# Altium project power-v3.1.PrjPCB (part 1 of 2)
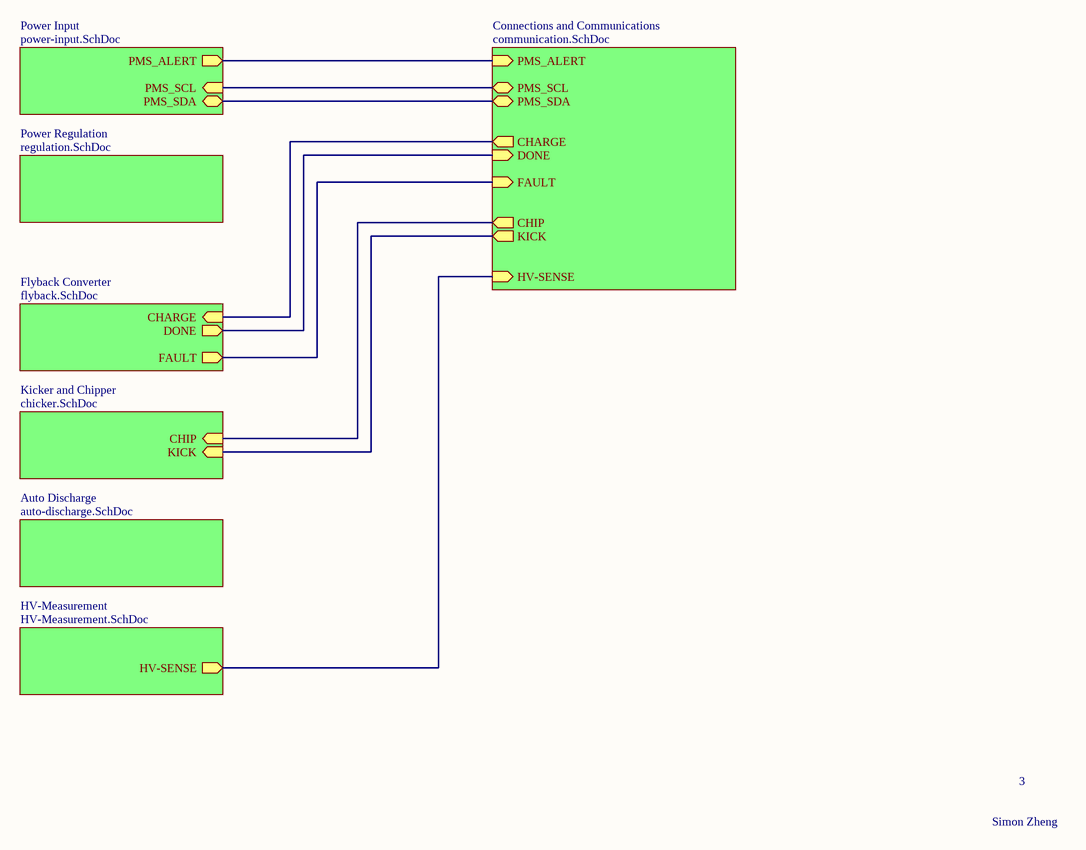
[diagram p0: power-v3.1.SchDoc]
8 sheets, 154 parts. Net scope: hierarchical (ports join the sheet entries above them; power ports are global).
Board file: power-v3.1.PcbDoc
Sheets:
  power-v3.1.SchDoc
    Flyback Converter = flyback.SchDoc
    Power Regulation = regulation.SchDoc
    Kicker and Chipper = chicker.SchDoc
    Power Input = power-input.SchDoc
    Connections and Communications = communication.SchDoc
    Auto Discharge = auto-discharge.SchDoc
    HV-Measurement = HV-Measurement.SchDoc

## Sheet power-v3.1.SchDoc
size A4

### Sub-sheets
Auto Discharge = auto-discharge.SchDoc: no entries
Connections and Communications = communication.SchDoc: PMS_SCL (bidir), PMS_SDA (bidir), DONE (in), CHARGE (out), PMS_ALERT (in), FAULT (in), KICK (out), HV-SENSE (in), CHIP (out)
Flyback Converter = flyback.SchDoc: FAULT (out), DONE (out), CHARGE (in)
HV-Measurement = HV-Measurement.SchDoc: HV-SENSE (out)
Kicker and Chipper = chicker.SchDoc: CHIP (in), KICK (in)
Power Input = power-input.SchDoc: PMS_SDA (bidir), PMS_SCL (in), PMS_ALERT (out)
Power Regulation = regulation.SchDoc: no entries

### Nets
CHARGE: sheet Flyback Converter/CHARGE, sheet Connections and Communications/CHARGE
CHIP: sheet Kicker and Chipper/CHIP, sheet Connections and Communications/CHIP
DONE: sheet Flyback Converter/DONE, sheet Connections and Communications/DONE
FAULT: sheet Flyback Converter/FAULT, sheet Connections and Communications/FAULT
HV-SENSE: sheet Connections and Communications/HV-SENSE, sheet HV-Measurement/HV-SENSE
KICK: sheet Kicker and Chipper/KICK, sheet Connections and Communications/KICK
PMS_ALERT: sheet Power Input/PMS_ALERT, sheet Connections and Communications/PMS_ALERT
PMS_SCL: sheet Power Input/PMS_SCL, sheet Connections and Communications/PMS_SCL
PMS_SDA: sheet Power Input/PMS_SDA, sheet Connections and Communications/PMS_SDA

### Notes on the sheet
- 3
- Simon Zheng

## Sheet flyback.SchDoc
size A4; SheetNumber: 4
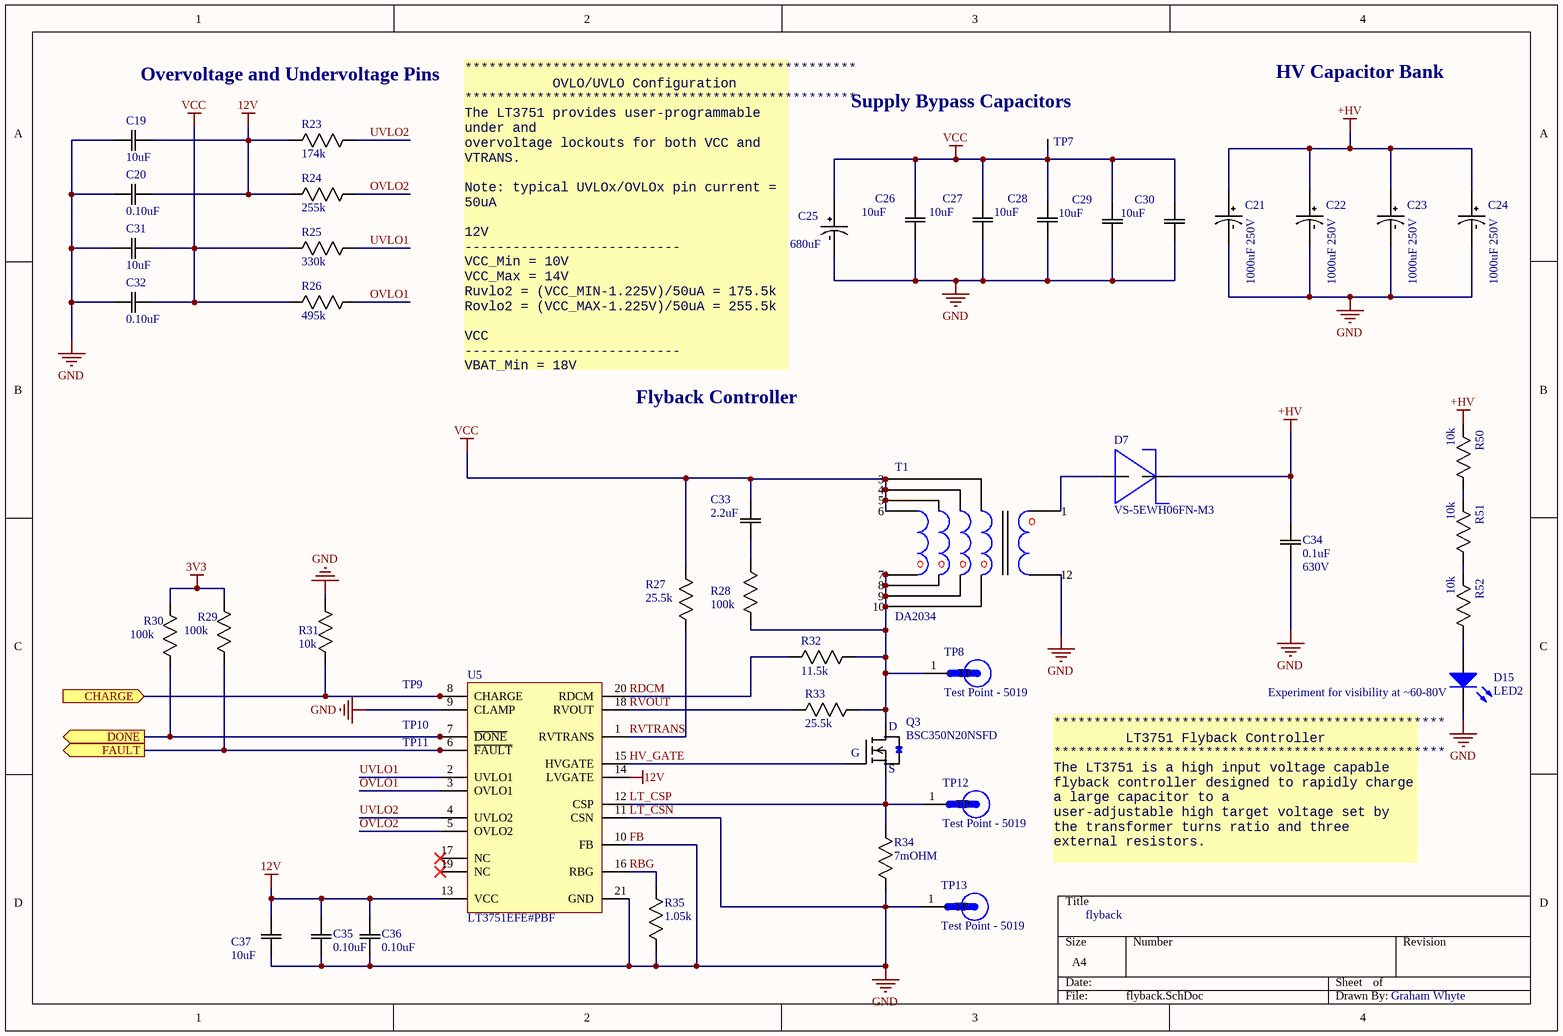
[diagram p1: flyback.SchDoc]

### Parts
(Parts that share a designator on the sheet are numbered #1, #2 ... from top to bottom, then left to right.)
C19  10uF  [0805]
C20  0.10uF  [0805]
C21  1000uF 250V  [RADIAL, CAN - THRU 25.4mm]
C22  1000uF 250V  [RADIAL, CAN - THRU 25.4mm]
C23  1000uF 250V  [RADIAL, CAN - THRU 25.4mm]
C24  1000uF 250V  [RADIAL, CAN - THRU 25.4mm]
C25  680uF  [RADIAL, CAN - THRU 10mm - RIGHTANGLE]
C26  10uF  [1210]
C27  10uF  [1210]
C28  10uF  [1210]
C29  10uF  [1210]
C30  10uF  [1210]
C31  10uF  [0805]
C32  0.10uF  [0805]
C33  2.2uF  [0805]
C34  Rating: 630V  [1210]  (hidden comment: 0.1uF)
C35  0.10uF  [0805]
C36  0.10uF  [0805]
C37  10uF  [0805]
D7  VS-5EWH06FN-M3  [DPAK (TO-252)]
D15  LED2  [3.2X1.6X1.1]
Q3  BSC350N20NSFD  [8-PowerSMD]
R23  174k  [0805]
R24  255k  [0805]
R25  330k  [0805]
R26  495k  [0805]
R27  25.5k  [0805]
R28  100k  [0805]
R29  100k  [0805]
R30  100k  [0805]
R31  10k  [0805]
R32  11.5k  [0805]
R33  25.5k  [0805]
R34  7mOHM  [2512]
R35#1  1.05k  [0805]
R50  10k  [1206]
R51  10k  [1206]
R52  10k  [1206]
T1  DA2034  [DA2034]
TP7#1  Test Point (Via)  [TP]  (value not drawn)
TP8  Test Point - 5019  [TP380X203]
TP9  Test Point (Via)  [TP]  (value not drawn)
TP10  Test Point (Via)  [TP]  (value not drawn)
TP11  Test Point (Via)  [TP]  (value not drawn)
TP12  Test Point - 5019  [TP380X203]
TP13  Test Point - 5019  [TP380X203]
U5  LT3751EFE#PBF  [LT-FE-20-EPV-CB_L]

### Ports
CHARGE (in), DONE (out), FAULT (out)

### Nets
3V3: R29.2(R2) R30.2(R2)
12V: C19.2(C2) C20.2(C2) C35.1(C1) C36.1(C1) C37.1(C1) R23.2(R2) R24.2(R2) U5.13(VCC) U5.14(LVGATE)
+HV: C21.POS C22.POS C23.POS C24.POS C34.1(C1) D7.OUT R50.2(R2)
GND: C19.1(C1) C20.1(C1) C21.NEG C22.NEG C23.NEG C24.NEG C25.NEG C26.1(C1) C27.1(C1) C28.1(C1) C29.1(C1) C30.1(C1) C31.1(C1) C32.1(C1) C34.2(C2) C35.2(C2) C36.2(C2) C37.2(C2) D15.2(K) R31.1(R1) R34.1(R1) R35#1.2(R2) T1.12 TP13.1(TP) U5.9(CLAMP) U5.10(FB) U5.11(CSN) U5.21(GND)  [also labelled FB, LT_CSN]
VCC: C25.POS C26.2(C2) C27.2(C2) C28.2(C2) C29.2(C2) C30.2(C2) C31.2(C2) C32.2(C2) C33.2(C2) R25.2(R2) R26.2(R2) R27.1(R1) T1.3 T1.4 T1.5 T1.6 TP7#1.1
CHARGE: R31.2(R2) TP9.1 U5.8(CHARGE) ; port CHARGE
DONE: R30.1(R1) TP10.1 U5.7(~{DONE}) ; port DONE
FAULT: R29.1(R1) TP11.1 U5.6(~{FAULT}) ; port FAULT
HV_GATE: Q3.G U5.15(HVGATE)
LT_CSP: Q3.S R34.2(R2) TP12.1(TP) U5.12(CSP)
OVLO1: R26.1(R1) U5.3(OVLO1)
OVLO2: R24.1(R1) U5.5(OVLO2)
RBG: R35#1.1(R1) U5.16(RBG)
RDCM: R32.2(R2) U5.20(RDCM)
RVOUT: R33.2(R2) U5.18(RVOUT)
RVTRANS: R27.2(R2) U5.1(RVTRANS)
UVLO1: R25.1(R1) U5.2(UVLO1)
UVLO2: R23.1(R1) U5.4(UVLO2)
NetC33_1: C33.1(C1) R28.1(R1)
NetD7_IN: D7.IN T1.1
NetD15_1: D15.1(A) R52.1(R1)
NetQ3_D: Q3.D R28.2(R2) R32.1(R1) R33.1(R1) T1.7 T1.8 T1.9 T1.10 TP8.1(TP)
NetR50_1: R50.1(R1) R51.2(R2)
NetR51_1: R51.1(R1) R52.2(R2)

Not connected (* = marked no-connect by the designer): U5 17(NC)* 19(NC)*

### Notes on the sheet
- Overvoltage and Undervoltage Pins
- (near TP7#1) Supply Bypass Capacitors
- HV Capacitor Bank
- (near C25) *************************************************
  OVLO/UVLO Configuration
  *************************************************
  The LT3751 provides user-programmable under and
  overvoltage lockouts for both VCC and VTRANS.
  Note: typical UVLOx/OVLOx pin current = 50uA
  12V
  ---------------------------
  VCC_Min = 10V
  VCC_Max = 14V
  Ruvlo2 = (VCC_MIN-1.225V)/50uA = 175.5k
  Rovlo2 = (VCC_MAX-1.225V)/50uA = 255.5k
  VCC
  ---------------------------
  VBAT_Min = 18V
  VBAT_Max = 26V
  Ruvlo1 = (VBAT_MIN-1.225V)/50uA = 335.5k
  Rovlo1 = (VBAT_MAX-1.225V)/50uA = 495.5k
- Flyback Controller
- (near D15) Experiment for visibility at ~60-80V
- (near D15) *************************************************
  LT3751 Flyback Controller
  *************************************************
  The LT3751 is a high input voltage capable flyback controller designed to rapidly charge a large capacitor to a
  user-adjustable high target voltage set by the transformer turns ratio and three external resistors.
- flyback
- Graham Whyte

### Library data of the parts
C19 C26-C31 C37 = CAP 10uF 35V: CAP CER 10UF 35V X7R 0805; Tolerance: 10%; Package: 0805; Value: 10uF; Rating: 35V; Temperature Coefficient: X7R; Operating Temperature: -55°C ~ 125°C
C20 C32 C35 C36 = CAP 0.10uF 35V: CAP CER 0.10UF 35V X7R 0603/0805; Tolerance: 10%; Package: 0603/0805; Temperature Coefficient: X7R; Operating Temperature: -55°C ~ 125°C; Value: 0.10uF
C21-C24 = CAP POL 1000uF: United Chemi-Con / ESMQ251VSN102MQ45S; Dielectric Material: Aluminium; Life (Hours): 2000Hour; Capacitance: 1mF; Tolerance: 20%; Ripple Current: 960mA; Lead Diameter: 2mm; Supplier 1: Digi-Key; Manufacturer: United Chemi-Con; Manufacturer Part Number: ESMQ251VSN102MQ45S; RoHS: Yes; Mount: Through Hole,PCB; Case/Package: Radial; Number of Pins: 2; Min Operating Temperature: -40°C; Max Operating Temperature: 85°C; Termination: Radial; Voltage: 250V; Diameter: 25.4mm; Height - Seated (Max): 45mm; Lead Pitch: 10mm; REACH SVHC: No SVHC; Lead Free: Lead Free; Supplier Part Number 1: 565-2754-ND
C25 = CAP POL 680uF TH: NICHICON   UHW1V681MPD6 ALUMINUM ELECTROLYTIC CAPACITOR, 680UF, 35V, 20%, RADIAL, FULL REEL; Dielectric Material: Aluminium; Tolerance: 20%; Supplier 1: Digi-Key; Manufacturer: Nichicon; Manufacturer Part Number: UHW1V681MPD6; RoHS: Yes; Case/Package: Radial; Number of Pins: 2; Capacitance: 680uF; Termination: Radial; Voltage: 35V; Supplier Part Number 1: 493-6804-ND
C33 = CAP 2.2uF 16V: CAP CER 2.2UF 16V X5R 0603/0805; Tolerance: 10%; Package: 0603/0805; Value: 2.2uF; Rating: 16V; Temperature Coefficient: X5R; Operating Temperature: -55°C ~ 85°C
C34 = CAP 0.1uF 630V: CAP CER 0.1uF 630V X7R 1210; Tolerance: 10%; Package: 1210; Temperature Coefficient: X7R; Operating Temperature: -55°C ~ 125°C; Value: 0.1uF
D7 = VS-5EWH06FN-M3: Diode Switching 600V 5A DPAK; pin to pad: IN>3 OUT>2; MF: Vishay Diodes; MF PN: VS-5EWH06FN-M3; Digikey: VS-5EWH06FN-M3-ND; Digikey Link: https://www.digikey.ca/en/products/detail/vishay-semiconductor-diodes-division/VS-5EWH06FN-M3/4934509
D15 = LED GREEN SMD: Typical RED, GREEN, YELLOW, AMBER GaAs LED; Voltage - Forward (Vf) (Typ): 2V; Lens Transparency: Clear; Current - Test: 20mA; Package: 1206; Color: Green
Q3 = MOSFET BSC320N20NS3: MOSFET N-CH 36A 200V; MF: Infineon; Package: 8-PowerTDFN; Digikey: BSC320N20NS3GATMA1CT-ND; Digikey Link: https://www.digikey.ca/en/products/detail/infineon-technologies/BSC320N20NS3GATMA1/2337851; Supplier 1: Digi-Key; Supplier Part Number 1: BSC320N20NS3GATMA1CT-ND
R23 = RES 174k 1/8W: RES SMD 174K OHM 1% 1/8W 0805; Manufacturer: Yageo; Manufacturer Part Number: RC0805FR-07174KL; Max Power Dissipation: 125mW; Resistance: 174kR; Temperature Coefficient: 100ppm/°C; Voltage Rating: 150V; Supplier 1: Digi-Key; RoHS: Yes; Category: Chip SMD Resistors; Stock 1: 27863; Pricing 1: 1=0.10000, 10=0.04000, 100=0.01630, 1000=0.00731, 2500=0.00635 (USD); Case/Package: 0805; Case Code (Metric): 2012; Case Code (Imperial): 0805; Contact Plating: Tin,Matte; Min Operating Temperature: -55°C; Max Operating Temperature: 155°C; Package Quantity: 1; Power Rating: 125mW; Tolerance: 1%; Packaging: Tape and Reel; Features: Moisture Resistant; Composition: Thick Film; Number of Terminations: 2; Termination: SMD/SMT; Military Standard: Not; Voltage Rating (DC): 150V; Length: 2mm; Height: 0.024inch; Width: 0.049inch; Depth: 1.25mm; Radiation Hardening: No; Lead Free: Lead Free; ComponentLink1URL: https://datasheet.ciiva.com/2509/pyu-r-int-thick-7-2509472.pdf?src-supplier=Digi-Key; ComponentLink1Description: https://datasheet.ciiva.com/2509/pyu-r-int-thick-7-2509472.pdf?src-supplier=Digi-Key; ComponentLink2URL: https://datasheet.ciiva.com/2509/pyu-r-int-thick-7-2509471.pdf?src-supplier=Digi-Key; ComponentLink2Description: https://datasheet.ciiva.com/2509/pyu-r-int-thick-7-2509471.pdf?src-supplier=Digi-Key; ComponentLink3URL: https://datasheet.ciiva.com/2509/pyu-r-int-thick-7-2509473.pdf?src-supplier=Digi-Key; ComponentLink3Description: https://datasheet.ciiva.com/2509/pyu-r-int-thick-7-2509473.pdf?src-supplier=Digi-Key; Supplier Part Number 1: 311-174KCRCT-ND
R24 = RES 255k 0805: 0805 Resistor, 6A, 0.125W, 25ppm, 0.1%, 255K; Manufacturer: Panasonic; Manufacturer Part Number: ERA-6AEB2553V; Max Power Dissipation: 125mW; Resistance: 255kR; Temperature Coefficient: 25ppm/°C; Voltage Rating (DC): 100V; Voltage Rating: 200V; Supplier 1: Digi-Key; RoHS: Yes; Category: Chip SMD Resistors; Stock 1: 7869; Pricing 1: 1=0.36000, 10=0.30200, 100=0.11820, 1000=0.04948, 2500=0.04536 (USD); Mount: Surface Mount; Case/Package: 0805; Number of Pins: 2; Weight: 0.000194oz; Case Code (Imperial): 0805; Case Code (Metric): 2012; Contact Plating: Tin; Min Operating Temperature: -55°C; Max Operating Temperature: 155°C; Features: Automotive AEC-Q200; Tolerance: 0.1%; Number of Terminations: 2; Packaging: Tape and Reel; Composition: Metal Film,Thin Film; Power Rating: 125mW; Termination: SMD/SMT; Military Standard: Not; Package Quantity: 1; Length: 2mm; Height: 0.5mm; Width: 1.25mm; Depth: 1.25mm; Radiation Hardening: No; Lead Free: Lead Free; REACH SVHC: No SVHC; ComponentLink1URL: https://datasheet.ciiva.com/11810/0900766b80eb1d8c-11810615.pdf?src-supplier=RSComponents; ComponentLink1Description: https://datasheet.ciiva.com/11810/0900766b80eb1d8c-11810615.pdf?src-supplier=RSComponents; ComponentLink2URL: https://datasheet.ciiva.com/41450/001181380-da-01-en-widerstand-era-0805-255k-0-1-5000st-41450539.pdf?src-supplier=Conrad; ComponentLink2Description: https://datasheet.ciiva.com/41450/001181380-da-01-en-widerstand-era-0805-255k-0-1-5000st-41450539.pdf?src-supplier=Conrad; ComponentLink3URL: https://datasheet.ciiva.com/5981/485442-5981317.pdf?src-supplier=Farnell; ComponentLink3Description: https://datasheet.ciiva.com/5981/485442-5981317.pdf?src-supplier=Farnell; ComponentLink4URL: https://datasheet.ciiva.com/5981/485442-5981318.pdf?src-supplier=Farnell; ComponentLink4Description: https://datasheet.ciiva.com/5981/485442-5981318.pdf?src-supplier=Farnell; ComponentLink5URL: https://datasheet.ciiva.com/5981/485442-5981319.pdf?src-supplier=Farnell; ComponentLink5Description: https://datasheet.ciiva.com/5981/485442-5981319.pdf?src-supplier=Farnell; ComponentLink6URL: https://datasheet.ciiva.com/5981/485442-5981320.pdf?src-supplier=Farnell; ComponentLink6Description: https://datasheet.ciiva.com/5981/485442-5981320.pdf?src-supplier=Farnell; ComponentLink7URL: https://datasheet.ciiva.com/17206/aoa0000ce26-17206655.pdf?src-supplier=Avnet+Europe; ComponentLink7Description: https://datasheet.ciiva.com/17206/aoa0000ce26-17206655.pdf?src-supplier=Avnet+Europe; Supplier Part Number 1: P255KDACT-ND
R25 = RES 330k 1/8W - 1%: RES SMD 274K OHM 1% 1/8W 0805
R26 = RES 495k 1/8W: RES SMD 499K OHM 1% 1/8W 0805; Manufacturer: Yageo; Manufacturer Part Number: RC0805FR-07499KL; Temperature Coefficient: 100ppm/°C; Voltage Rating (DC): 150V; Resistance: 499kR; Power Rating: 125mW; Supplier 1: Digi-Key; RoHS: Yes; Category: Chip SMD Resistors; Stock 1: 2275; Pricing 1: 1=0.10000, 10=0.04000, 100=0.01630, 1000=0.00731, 2500=0.00635 (USD); Case/Package: 0805; Case Code (Metric): 2012; Case Code (Imperial): 0805; Contact Plating: Tin,Lead,Matte; Min Operating Temperature: -55°C; Max Operating Temperature: 155°C; Termination: SMD/SMT; Composition: Thick Film; Military Standard: Not; Tolerance: 1%; Voltage Rating: 150V; Packaging: Tape and Reel; Length: 2mm; Depth: 1.25mm; Radiation Hardening: No; Lead Free: Lead Free; ComponentLink1URL: https://datasheet.ciiva.com/15189/getdatasheetpartid-326570-15189975.pdf?src-supplier=Verical; ComponentLink1Description: https://datasheet.ciiva.com/15189/getdatasheetpartid-326570-15189975.pdf?src-supplier=Verical; Supplier Part Number 1: 311-499KCRCT-ND
R27 R33 = RES 25.5k 1/8W: RES SMD 25.5K OHM 0.1% 1/8W 0805; Manufacturer: Panasonic; Manufacturer Part Number: ERA-6AEB2552V; Temperature Coefficient: 25ppm/°C; Max Power Dissipation: 125mW; Resistance: 25.5kR; Voltage Rating: 100V; Supplier 1: Digi-Key; RoHS: Yes; Category: Chip SMD Resistors; Stock 1: 5872; Pricing 1: 1=0.36000, 10=0.30200, 100=0.11820, 1000=0.04948, 2500=0.04536 (USD); Mount: Surface Mount; Case/Package: 0805; Number of Pins: 2; Case Code (Imperial): 0805; Case Code (Metric): 2012; Contact Plating: Tin; Min Operating Temperature: -55°C; Max Operating Temperature: 155°C; Number of Terminations: 2; Features: Automotive AEC-Q200; Tolerance: 0.1%; Composition: Metal Film,Thin Film; Packaging: Tape and Reel; Military Standard: Not; Termination: Solder; Power Rating: 125mW; Package Quantity: 1; Voltage Rating (DC): 100V; Length: 2mm; Height: 0.5mm; Width: 1.25mm; Depth: 1.25mm; Radiation Hardening: No; Lead Free: Lead Free; ComponentLink1URL: https://datasheet.ciiva.com/11810/0900766b80eb1d8c-11810651.pdf?src-supplier=RSComponents; ComponentLink1Description: https://datasheet.ciiva.com/11810/0900766b80eb1d8c-11810651.pdf?src-supplier=RSComponents; ComponentLink2URL: https://datasheet.ciiva.com/26335/459526-da-01-en-widerstand-0805-era-26335831.pdf?src-supplier=Conrad; ComponentLink2Description: https://datasheet.ciiva.com/26335/459526-da-01-en-widerstand-0805-era-26335831.pdf?src-supplier=Conrad; ComponentLink3URL: https://datasheet.ciiva.com/7870/485442-7870651.pdf?src-supplier=Element14; ComponentLink3Description: https://datasheet.ciiva.com/7870/485442-7870651.pdf?src-supplier=Element14; ComponentLink4URL: https://datasheet.ciiva.com/5987/485442-5987308.pdf?src-supplier=Farnell; ComponentLink4Description: https://datasheet.ciiva.com/5987/485442-5987308.pdf?src-supplier=Farnell; ComponentLink5URL: https://datasheet.ciiva.com/7870/485442-7870652.pdf?src-supplier=Element14; ComponentLink5Description: https://datasheet.ciiva.com/7870/485442-7870652.pdf?src-supplier=Element14; ComponentLink6URL: https://datasheet.ciiva.com/30151/54aoa0000ce26-30151583.pdf?src-supplier=Onlinecomponents.com; ComponentLink6Description: https://datasheet.ciiva.com/30151/54aoa0000ce26-30151583.pdf?src-supplier=Onlinecomponents.com; ComponentLink7URL: https://datasheet.ciiva.com/9191/aoa0000ce26-9191422.pdf?src-supplier=Avnet; ComponentLink7Description: https://datasheet.ciiva.com/9191/aoa0000ce26-9191422.pdf?src-supplier=Avnet; Supplier Part Number 1: P25.5KDACT-ND
R28-R30 = RES 100k 1/8W - 1%: RES SMD 100K OHM 1% 1/8W 0805; Power (Watts): 0.125W; Package: 0805; Value: 100k; Tolerance: 1%
R31 = RES 10k 1/8W - 1%: RES SMD 10K OHM 1% 1/8W 0805; Power (Watts): 0.125W; Package: 0805; Value: 10k; Tolerance: 1%
R32 = RES 11.5k 1/8W: RES SMD 11.5K OHM 0.1% 1/8W 0805 Thin Film; Manufacturer: Panasonic; Manufacturer Part Number: ERA-6AEB1152V; Power Rating: 125mW; Resistance: 11.5kR; Voltage Rating: 100V; Temperature Coefficient: 25ppm/°C; Supplier 1: Digi-Key; RoHS: Yes; Category: Chip SMD Resistors; Stock 1: 10661; Pricing 1: 1=0.34000, 10=0.28800, 100=0.11260, 1000=0.04712, 2500=0.04320 (USD); Mount: Surface Mount; Case/Package: 0805; Number of Pins: 2; Case Code (Metric): 2012; Case Code (Imperial): 0805; Contact Plating: Tin; Min Operating Temperature: -55°C; Max Operating Temperature: 155°C; Tolerance: 0.1%; Packaging: Tape and Reel; Max Power Dissipation: 125mW; Composition: Thin Film,Metal Film; Number of Terminations: 2; Voltage Rating (DC): 100V; Termination: Solder; Military Standard: Not; Package Quantity: 1; Features: Automotive AEC-Q200; Length: 2mm; Height: 0.5mm; Width: 1.25mm; Depth: 1.25mm; Radiation Hardening: No; Lead Free: Lead Free; ComponentLink1URL: https://datasheet.ciiva.com/11810/0900766b80eb1d8c-11810868.pdf?src-supplier=RSComponents; ComponentLink1Description: https://datasheet.ciiva.com/11810/0900766b80eb1d8c-11810868.pdf?src-supplier=RSComponents; ComponentLink2URL: https://datasheet.ciiva.com/41450/001181306-da-01-en-widerstand-era-0805-11k5-0-1-5000st-41450464.pdf?src-supplier=Conrad; ComponentLink2Description: https://datasheet.ciiva.com/41450/001181306-da-01-en-widerstand-era-0805-11k5-0-1-5000st-41450464.pdf?src-supplier=Conrad; ComponentLink3URL: https://datasheet.ciiva.com/5987/485442-5987301.pdf?src-supplier=Farnell; ComponentLink3Description: https://datasheet.ciiva.com/5987/485442-5987301.pdf?src-supplier=Farnell; ComponentLink4URL: https://datasheet.ciiva.com/7829/485442-7829142.pdf?src-supplier=Element14; ComponentLink4Description: https://datasheet.ciiva.com/7829/485442-7829142.pdf?src-supplier=Element14; ComponentLink5URL: https://datasheet.ciiva.com/17211/aoa0000ce26-17211855.pdf?src-supplier=Avnet+Europe; ComponentLink5Description: https://datasheet.ciiva.com/17211/aoa0000ce26-17211855.pdf?src-supplier=Avnet+Europe; ComponentLink6URL: https://datasheet.ciiva.com/7829/485442-7829143.pdf?src-supplier=Element14; ComponentLink6Description: https://datasheet.ciiva.com/7829/485442-7829143.pdf?src-supplier=Element14; ComponentLink7URL: https://datasheet.ciiva.com/9193/aoa0000ce26-9193735.pdf?src-supplier=Avnet; ComponentLink7Description: https://datasheet.ciiva.com/9193/aoa0000ce26-9193735.pdf?src-supplier=Avnet; ComponentLink8URL: https://datasheet.ciiva.com/24024/aoa0000ce26-197354-24024328.pdf?src-supplier=Mouser; ComponentLink8Description: https://datasheet.ciiva.com/24024/aoa0000ce26-197354-24024328.pdf?src-supplier=Mouser; Supplier Part Number 1: P11.5KDACT-ND
R34 = RES 7m 3W: RES SMD 7m OHM 1% 3W 2512; MFG: VISHAY; Package: 1206; Resistance: 7mOHM; Power (Watts): 3W; Tolerance: 1%
R35#1 = RES 1.05k 1/8W: RES SMD 1.05K OHM 0.1% 1/8W 0805; Wattage: 0.125W; Supplier 1: Digi-Key; Tolerance: 0.1%; Supplier Part Number 1: P1.05KDACT-ND; Value: 1.05k; Package: 0805
R50-R52 = RES 10k 1W: RES SMD 10K OHM 1% 1W 1206; Power (Watts): 0.125W; Package: 0805; Value: 10k; Tolerance: 1%
T1 = DA2034: Audio Transformers / Signal Transformers DA2032 Cap Chrgr For Linear LT3750/51; Supplier 1: Mouser; Supplier Part Number 1: 994-DA2034-ALB
TP8 TP12 TP13 = Test Point - 5019: PC Test Point, Miniature Phosphor Bronze, Silver Plating Surface Mount Mounting Type; MP: 5019; MF: Keystone Electronics; Value: *; Package: 2010 Keystone; Digi-Key_Part_Number: 36-5019CT-ND; Digi-Key_Purchase_URL: https://www.digikey.com/product-detail/en/keystone-electronics/5019/36-5019CT-ND/3907344?utm_source=snapeda&utm_medium=aggregator&utm_campaign=symbol
U5 = LT3751EFE#PBF: Controller to 20-Pin TSSOP EP; Manufacturer: Analog Devices / Linear Technology; Output Voltage: 500V; Output Current: 150mA; Max Input Voltage: 24V; Min Supply Voltage: 4.75V; Number of Outputs: 1; Operating Supply Current: 5.5mA; Supplier 1: Digi-Key; Manufacturer Part Number: LT3751EFE#PBF; RoHS: Yes; Category: Voltage Regulators - Switching; Stock 1: 1231; Pricing 1: 1=9.26000, 25=6.14640, 100=5.08200, 250=4.82792, 500=4.71900 (USD); Case/Package: TSSOP; Number of Pins: 20; Min Operating Temperature: -40°C; Max Operating Temperature: 125°C; Package Quantity: 74; Packaging: Rail/Tube; Termination: SMD/SMT; Max Supply Voltage: 24V; Radiation Hardening: No; REACH SVHC: No SVHC; ComponentLink1URL: https://datasheet.ciiva.com/15104/getdatasheetpartid-472813-15104438.pdf?src-supplier=Verical; ComponentLink1Description: https://datasheet.ciiva.com/15104/getdatasheetpartid-472813-15104438.pdf?src-supplier=Verical; ComponentLink2URL: https://datasheet.ciiva.com/31429/1692507-31429494.pdf?src-supplier=Farnell; ComponentLink2Description: https://datasheet.ciiva.com/31429/1692507-31429494.pdf?src-supplier=Farnell; ComponentLink3URL: https://datasheet.ciiva.com/1964/27024-1964843.pdf?src-supplier=Digi-Key; ComponentLink3Description: https://datasheet.ciiva.com/1964/27024-1964843.pdf?src-supplier=Digi-Key

## Sheet regulation.SchDoc
size A4; SheetNumber: 3
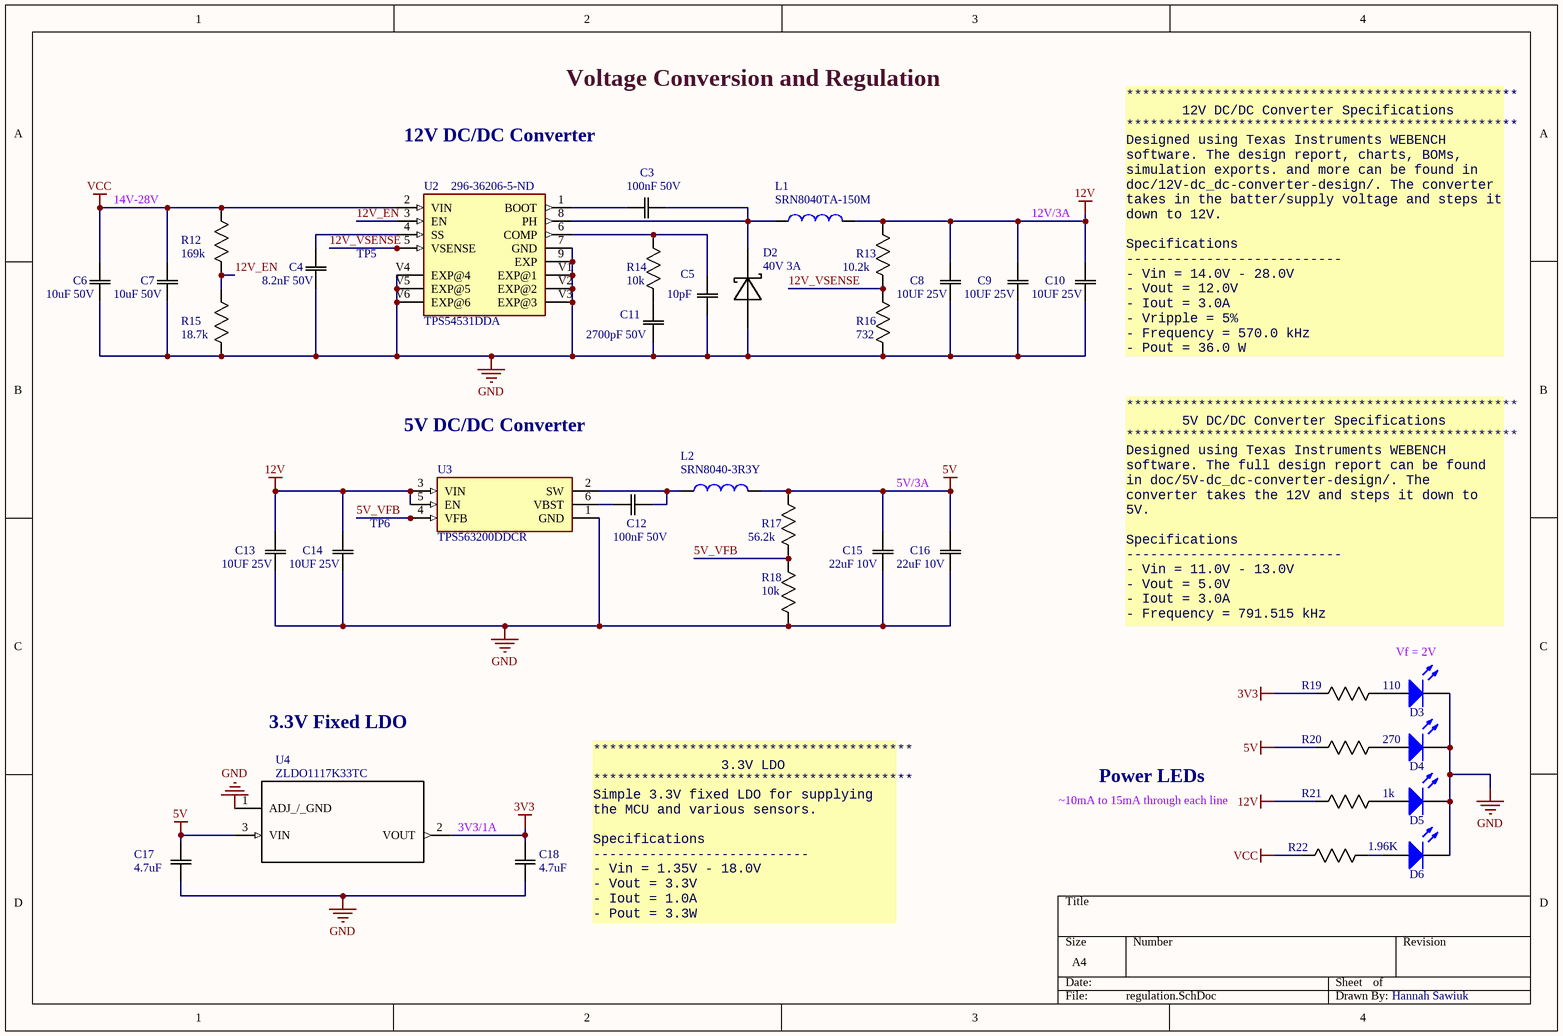
[diagram p2: regulation.SchDoc]

### Parts
(Parts that share a designator on the sheet are numbered #1, #2 ... from top to bottom, then left to right.)
C3  100nF 50V  [0805]
C4  8.2nF 50V  [0805]
C5  10pF  [0805]
C6  10uF 50V  [1210]
C7  10uF 50V  [1210]
C8  10UF 25V  [1206]
C9  10UF 25V  [1206]
C10  10UF 25V  [1206]
C11  2700pF 50V  [0805]
C12  100nF 50V  [0805]
C13  10UF 25V  [1206]
C14  10UF 25V  [1206]
C15  22uF 10V  [0805]
C16  22uF 10V  [0805]
C17  4.7uF  [0805]
C18  4.7uF  [0805]
D2  40V 3A  [DO-214AC]
D3  LED2  [3.2X1.6X1.1]  (value not drawn)
D4  LED2  [3.2X1.6X1.1]  (value not drawn)
D5  LED2  [3.2X1.6X1.1]  (value not drawn)
D6  LED2  [3.2X1.6X1.1]  (value not drawn)
L1  SRN8040TA-150M  [INDP8279X40M]
L2  SRN8040-3R3Y  [INDP8279X40M]
R12  169k  [0805]
R13  10.2k  [0805]
R14  10k  [0805]
R15  18.7k  [0805]
R16  732  [0805]
R17  56.2k  [0805]
R18  10k  [0805]
R19  110  [0805]
R20  270  [0805]
R21  1k  [0805]
R22  1.96K  [0805]
TP5#1  Test Point (Via)  [TP]  (value not drawn)
TP6#1  Test Point (Via)  [TP]  (value not drawn)
U2  TPS54531DDA  Supplier Part Number 1: 296-36206-5-ND  [8-PowerSOIC]
U3  TPS563200DDCR  [TSOT-23-6]
U4  ZLDO1117K33TC  [DPAK (TO-252)]

### Nets
3V3: C18.1(C1) R19.1(R1) U4.2(VOUT)
5V: C15.2(C2) C16.2(C2) C17.1(C1) L2.2 R17.1(R1) R20.1(R1) U4.3(VIN)
12V: C8.2(C2) C9.2(C2) C10.2(C2) C13.2(C2) C14.2(C2) L1.2 R13.2(R2) R21.1(R1) U3.3(VIN) U3.5(EN)
GND: C4.1(C1) C5.1(C1) C6.1(C1) C7.1(C1) C8.1(C1) C9.1(C1) C10.1(C1) C11.1(C1) C13.1(C1) C14.1(C1) C15.1(C1) C16.1(C1) C17.2(C2) C18.2(C2) D2.A D3.2(K) D4.2(K) D5.2(K) D6.2(K) R15.2(R2) R16.1(R1) R18.1(R1) U2.7(GND) U2.9(EXP) U2.V1(EXP@1) U2.V2(EXP@2) U2.V3(EXP@3) U2.V4(EXP@4) U2.V5(EXP@5) U2.V6(EXP@6) U3.1(GND) U4.1(ADJ_/_GND)
VCC: C6.2(C2) C7.2(C2) R12.1(R1) R22.1(R1) U2.2(VIN)
5V_VFB: R17.2(R2) R18.2(R2) TP6#1.1 U3.4(VFB)
12V_EN: R12.2(R2) R15.1(R1) U2.3(EN)
12V_VSENSE: R13.1(R1) R16.2(R2) TP5#1.1 U2.5(VSENSE)
NetC3_1: C3.1(C1) U2.1(BOOT)
NetC3_2: C3.2(C2) D2.C(K) L1.1 U2.8(PH)
NetC4_2: C4.2(C2) U2.4(SS)
NetC5_2: C5.2(C2) R14.1(R1) U2.6(COMP)
NetC11_2: C11.2(C2) R14.2(R2)
NetC12_1: C12.1(C1) U3.6(VBST)
NetC12_2: C12.2(C2) L2.1 U3.2(SW)
NetD3_1: D3.1(A) R19.2(R2)
NetD4_1: D4.1(A) R20.2(R2)
NetD5_1: D5.1(A) R21.2(R2)
NetD6_1: D6.1(A) R22.2(R2)

### Notes on the sheet
- Voltage Conversion and Regulation
- 12V DC/DC Converter
- 14V-28V
- 12V/3A
- (near C10) *************************************************
  12V DC/DC Converter Specifications
  *************************************************
  Designed using Texas Instruments WEBENCH software. The design report, charts, BOMs, simulation exports. and more can be found in doc/12V-dc_dc-converter-design/. The converter takes in the batter/supply voltage and steps it down to 12V.
  Specifications
  ---------------------------
  - Vin = 14.0V - 28.0V
  - Vout = 12.0V
  - Iout = 3.0A
  - Vripple = 5%
  - Frequency = 570.0 kHz
  - Pout = 36.0 W
- 5V DC/DC Converter
- 5V/3A
- *************************************************
  5V DC/DC Converter Specifications
  *************************************************
  Designed using Texas Instruments WEBENCH software. The full design report can be found in doc/5V-dc_dc-converter-design/. The converter takes the 12V and steps it down to 5V.
  Specifications
  ---------------------------
  - Vin = 11.0V - 13.0V
  - Vout = 5.0V
  - Iout = 3.0A
  - Frequency = 791.515 kHz
  - Pout = 15.0 W
- Vf = 2V
- 3.3V Fixed LDO
- Power LEDs
- 3V3/1A
- ~10mA to 15mA through each line
- ****************************************
  3.3V LDO
  ****************************************
  Simple 3.3V fixed LDO for supplying the MCU and various sensors.
  Specifications
  ---------------------------
  - Vin = 1.35V - 18.0V
  - Vout = 3.3V
  - Iout = 1.0A
  - Pout = 3.3W
- Hannah Sawiuk

### Library data of the parts
C3 C12 = CAP 100nF 50V: CAP CER 0.1UF 50V X7R 0805; Tolerance: 10%; Package: 0805; Value: 100nF; Rating: 50V
C4 = CAP 8.2nF 50V: CAP CER 8200PF 50V X7R 0805; Tolerance: 10%; Package: 0805; Value: 8.2nF; Rating: 50V; Temperature Coefficient: X7R; Operating Temperature: -55°C ~ 125°C
C5 = CAP 10pF 50V: CAP CER 10PF 50V X7R 0603/0805; Tolerance: 10%; Package: 0603/0805; Value: 10pF; Rating: 50V; Temperature Coefficient: X7R; Operating Temperature: -55°C ~ 125°C
C6 C7 = CAP 10uF 50V: CAP CER 10UF 50V X7R; Tolerance: 10%; Package: 1210; Value: 10uF; Rating: 50V; ComponentLink1Description: digikey; ComponentLink1URL: https://www.digikey.ca/en/products/detail/kemet/C1210C106M5RACTU/4918883
C8-C10 C13 C14 = CAP 10uF 25V: CAP CER 10UF 25V X5R 1206; Tolerance: 10%; Package: 1206; Value: 10uF; Rating: 25V; Temperature Coefficient: X5R; Operating Temperature: -55°C ~ 85°C
C11 = CAP 2700pF 50V: CAP CER 2700PF 50V X7R 0805; Tolerance: 10%; Package: 0805; Value: 2700pF; Rating: 50V; Temperature Coefficient: X7R; Operating Temperature: -55°C ~ 125°C
C15 C16 = CAP 22uF 10V: CAP CER 2.2UF 10V X5R 0805; Tolerance: 20%; Package: 0805; Value: 22uF; Rating: 10V; Temperature Coefficient: X5R; Operating Temperature: -55°C ~ 85°C
C17 C18 = CAP 4.7uF 6.3V: CAP CER 4.7UF 6.3V X5R 0603/0805; Tolerance: 10%; Package: 0603/0805; Value: 4.7uF; Rating: 6.3V; Temperature Coefficient: X5R; Operating Temperature: -55°C ~ 85°C
D2 = DIODE SCHOTTKY 40V 3A: Diode Schottky 40V 3A Surface Mount SMA; Voltage - Forward (Vf) (Max) @ If: 450mV @ 3A; ComponentLink1Description: digikey; ComponentLink1URL: https://www.digikey.ca/product-detail/en/on-semiconductor/MBR0540T1G/MBR0540T1GOSCT-ND/917967; Voltage - DC Reverse (Vr) (Max): 40V; Package: DO-214AC; Current - Average Rectified (Io): 3A
D3-D6 = LED GREEN SMD: as D15 on sheet flyback; Package: 1206; Color: Green
L1 = IND 15UH 3.2A 50 MOHM: 15µH Semi-Shielded Wirewound Inductor 2.4A 70mOhm Max Nonstandard; MF: Bourns Inc.; Inductance: 15.0uH; Current - Saturation: 4A; DC Resistance (DCR): 50mOhm; MP: SRN8040TA-150M; Height - Seated (Max): 4.2mm; ComponentLink1Description: digikey; ComponentLink1URL: https://www.digikey.ca/en/products/detail/bourns-inc/SRU1048-8R2Y/2352912; Digikey: SRN8040TA-150MCT-ND; Digikey Link: https://www.digikey.ca/en/products/detail/bourns-inc/SRN8040TA-150M/6155130; Operating Temperature: -40°C ~ 125°C; Size / Dimension: 0.512"" L x 0.512"" W (13.00mm x 13.00mm); Supplier 1: Digi-Key
L2 = IND 3.3UH 5.6A 21 MOHM SMD: 3.3µH Semi-Shielded Wirewound Inductor 5.6A 21mOhm Max Nonstandard; MF: Bourns Inc.; Inductance: 3.3uH; MP: SRN8040-3R3Y; Price: None; Package: Nonstandard; ComponentLink1Description: digikey; ComponentLink1URL: https://www.digikey.ca/en/products/detail/bourns-inc/SRU1048-8R2Y/2352912; Digikey: SRN8040-3R3YCT-ND; Digikey Link: https://www.digikey.ca/en/products/detail/bourns-inc/SRN8040-3R3Y/2756131
R12 = RES 169k 1/8W: RES SMD 169K OHM 1% 1/8W 0805; Power (Watts): 0.125W; Package: 0805; Value: 169k; Tolerance: 1%; ComponentLink1Description: digikey; ComponentLink1URL: https://www.digikey.ca/en/products/detail/yageo/RC0805FR-07169KL/727634
R13 = RES 10.2k 1/8W: RES SMD 10.2K OHM 1% 1/8W 0805; Power (Watts): 0.125W; Package: 0805; Value: 10.2k; Tolerance: 1%; ComponentLink1Description: digikey; ComponentLink1URL: https://www.digikey.ca/en/products/detail/panasonic-electronic-components/ERJ-6ENF1022V/111476
R14 R18 = RES 10k 1/8W - 1%: as R31 on sheet flyback; Package: 0805; Value: 10k; Tolerance: 1%
R15 = RES 18.7K 1/8W: RES SMD 18.7K OHM 1% 1/8W 0805; Power (Watts): 0.125W; Alternative Package: 1206; Value: 18.7k; Tolerance: 1%; Package: 0805
R16 = RES 732.0 1/8W: RES SMD 732 OHM 1% 1/8W 0805; Power (Watts): 0.125W; Package: 0805; Value: 732; Tolerance: 1%
R17 = RES 56.2k 1/10W: RES SMD 56.2K OHM 1% 1/10W 0603; Power (Watts): 0.1W; Package: 0603; Value: 56.2k; Tolerance: 1%
R19 = RES 110.0 1/8W - 1%: RES SMD 110 OHM 1% 1/8W 0805; Power (Watts): 0.125W; Package: 0805; Value: 110; Tolerance: 1%
R20 = RES 270.0 1/8W: RES SMD 270 OHM 5% 1/8W 0805; Power (Watts): 0.125W; Package: 0805; Value: 270; Tolerance: 5%
R21 = RES 1k 1/8W: RES SMD 1K OHM 5% 1/8W 0805; Power (Watts): 0.125W; Package: 0805; Value: 1k; Tolerance: 5%
R22 = RES 1.96k 1/8W: RES SMD 1.96K OHM 1% 1/8W 0805; Power (Watts): 0.125W; Package: 0805; Value: 1.96k; Tolerance: 1%
U2 = TPS54531DDA: Buck Switching Regulator IC Positive Adjustable 0.8V 1 Output 5A 8-PowerSOIC _0.154, 3.90mm Width_; MF: Texas Instruments; Value: *; Price: None; Package: SO-8 Texas Instruments; SnapEDA_Link: https://www.snapeda.com/parts/TPS54531DDA/Texas%20Instruments/view-part/289535/?ref=snap; MP: TPS54531DDA; Supplier 1: Digi-Key
U3 = TPS563200DDCR: Buck Switching Regulator IC Positive Adjustable 0.76V 1 Output 3A SOT-23-6 Thin, TSOT-23-6; MF: Texas Instruments; Package: TSOT-23 Texas Instruments; Value: *; Price: None; MP: TPS563200DDCR; SnapEDA_Link: https://www.snapeda.com/parts/TPS563200DDCR/Texas%20Instruments/view-part/71685/?ref=snap; Availability: Unavailable; Supplier 1: Digi-Key; Supplier Part Number 1: 296-43663-1-ND
U4 = ZLDO1117K33TC: Linear Voltage Regulator IC Positive Fixed 1 Output  1A TO-252-3; MF: Diodes Incorporated; Package: TO-252-3; MP: ZLDO1117K33TC; Digikey: ZLDO1117K33DIDKR-ND; Digikey Link: https://www.digikey.ca/product-detail/en/diodes-incorporated/ZLDO1117K33TC/ZLDO1117K33DIDKR-ND/2095639; Supplier 1: Digi-Key; Supplier Part Number 1: ZLDO1117K33DICT-ND

## Sheet chicker.SchDoc
size A4; SheetNumber: 7
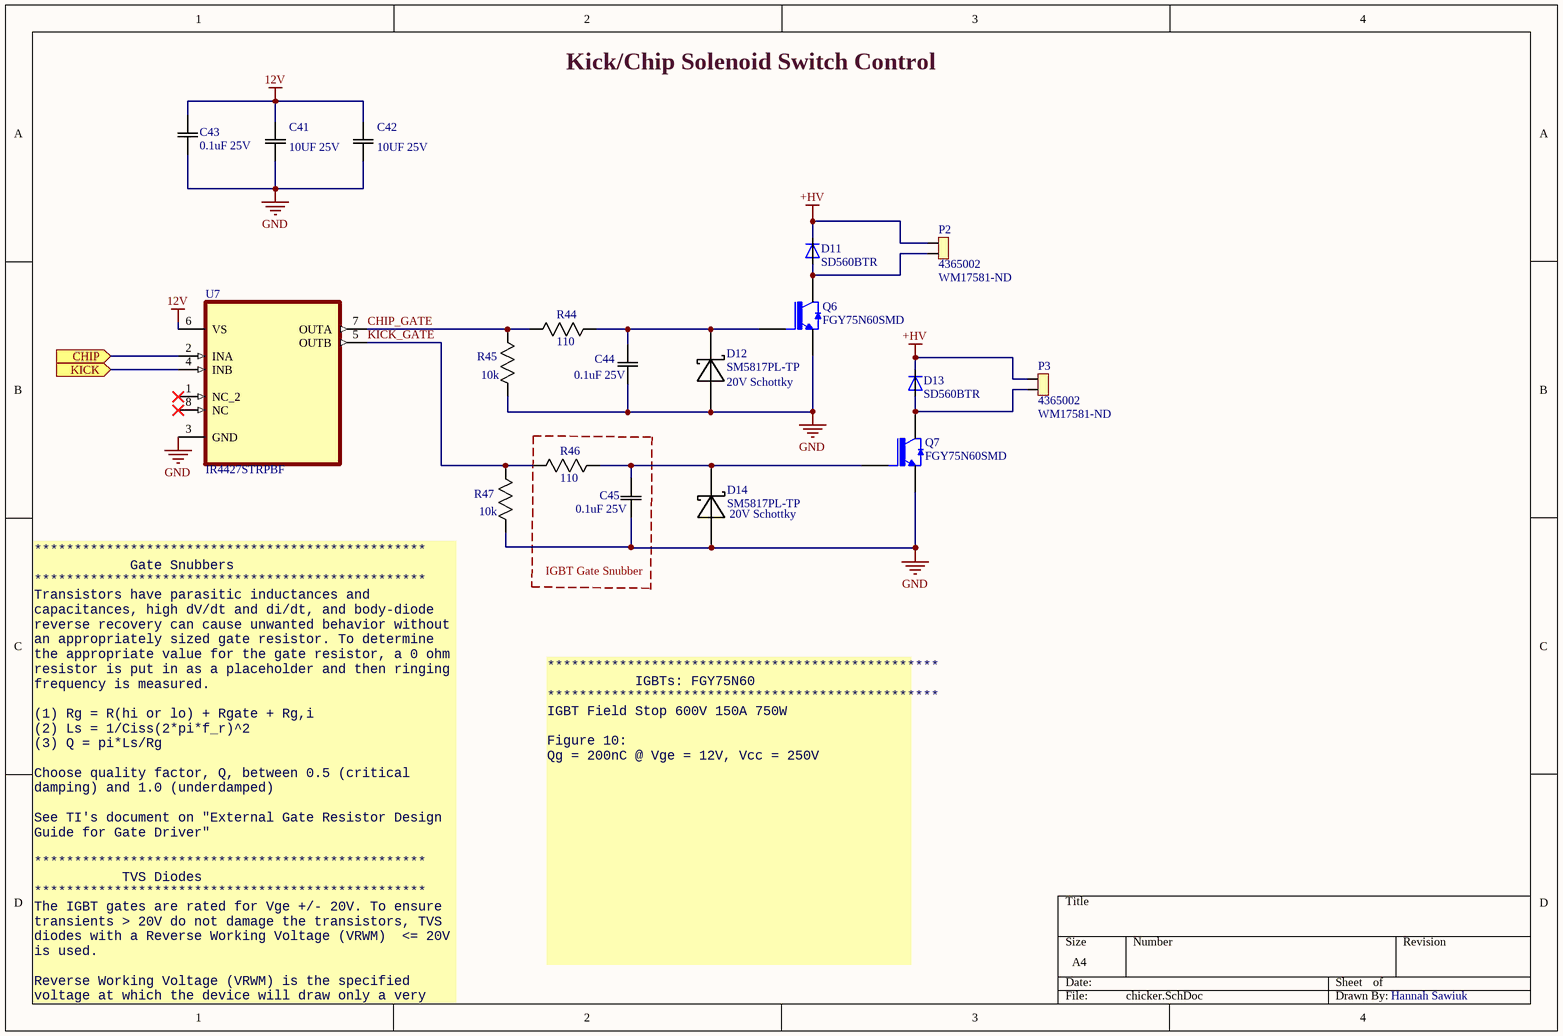
[diagram p3: chicker.SchDoc]

### Parts
(Parts that share a designator on the sheet are numbered #1, #2 ... from top to bottom, then left to right.)
C41  10UF 25V  [1206]
C42  10UF 25V  [1206]
C43  0.1uF 25V  [0805]
C44  0.1uF 25V  [0805]
C45  0.1uF 25V  [0805]
D11  SD560BTR  [DO-214AA]
D12  SM5817PL-TP  [SOD-123]
D13  SD560BTR  [DO-214AA]
D14  SM5817PL-TP  [SOD-123]
P2  4365002  Supplier Part Number 2: WM17581-ND  [43650-02]
P3  4365002  Supplier Part Number 2: WM17581-ND  [43650-02]
Q6  FGY75N60SMD  [TO-247-3]
Q7  FGY75N60SMD  [TO-247-3]
R44#1  110  [0805]
R45  10k  [0805]
R46  110  [0805]
R47  10k  [0805]
U7  IR4427STRPBF  [8-SOIC]

### Ports
CHIP (in), KICK (in)

### Nets
12V: C41.1(C1) C42.1(C1) C43.2(C2) U7.6(VS)
+HV: D11.C D13.C P2.1 P3.1
GND: C41.2(C2) C42.2(C2) C43.1(C1) C44.1(C1) C45.1(C1) D12.A D14.A Q6.3(E) Q7.3(E) R45.2(R2) R47.2(R2) U7.3(GND)
CHIP: U7.2(INA) ; port CHIP
CHIP_GATE: R44#1.2(R2) R45.1(R1) U7.7(OUTA)
KICK: U7.4(INB) ; port KICK
KICK_GATE: R46.2(R2) R47.1(R1) U7.5(OUTB)
NetC44_2: C44.2(C2) D12.C(K) Q6.1(G) R44#1.1(R1)
NetC45_2: C45.2(C2) D14.C(K) Q7.1(G) R46.1(R1)
NetD11_A: D11.A P2.2 Q6.2(C)
NetD13_A: D13.A P3.2 Q7.2(C)

Not connected (* = marked no-connect by the designer): U7 1(NC_2)* 8(NC)*

### Notes on the sheet
- Kick/Chip Solenoid Switch Control
- (near D12) 20V Schottky
- (near D14) 20V Schottky
- IGBT Gate Snubber
- *************************************************
  IGBTs: FGY75N60
  *************************************************
  IGBT Field Stop 600V 150A 750W
  Figure 10:
  Qg = 200nC @ Vge = 12V, Vcc = 250V
- (near R47) *************************************************
  Gate Snubbers
  *************************************************
  Transistors have parasitic inductances and capacitances, high dV/dt and di/dt, and body-diode reverse recovery can cause unwanted behavior without an appropriately sized gate resistor. To determine the appropriate value for the gate resistor, a 0 ohm resistor is put in as a placeholder and then ringing frequency is measured.
  (1) Rg = R(hi or lo) + Rgate + Rg,i
  (2) Ls = 1/Ciss(2*pi*f_r)^2
  (3) Q = pi*Ls/Rg
  Choose quality factor, Q, between 0.5 (critical damping) and 1.0 (underdamped)
  See TI's document on "External Gate Resistor Design Guide for Gate Driver"
  *************************************************
  TVS Diodes
  *************************************************
  The IGBT gates are rated for Vge +/- 20V. To ensure transients > 20V do not damage the transistors, TVS diodes with a Reverse Working Voltage (VRWM)  <= 20V is used.
  Reverse Working Voltage (VRWM) is the specified voltage at which the device will draw only a very small leakage current.
- Hannah Sawiuk

### Library data of the parts
C41 C42 = CAP 10uF 25V: as C8 on sheet regulation; Package: 1206; Value: 10uF; Rating: 25V; Temperature Coefficient: X5R; Operating Temperature: -55°C ~ 85°C
C43-C45 = CAP 0.1uF 25V: CAP CER 0.1UF 25V X7R 0805; Tolerance: 10%; Value: 0.1uF; Temperature Coefficient: X7R; Rating: 25V; Operating Temperature: -55°C ~ 125°C
D11 D13 = DIODE STANDARD 600V 5A: Diode Standard 600V 5A Surface Mount SMB; Supplier 1: Digi-Key; Supplier Part Number 1: 1655-1530-1-ND
D12 D14 = DIODE SCHOTTKY 20V 1A: Diode Schottky 20V 1A Surface Mount SOD-123FL; MF: Micro Commercial Co; ComponentLink1Description: digikey; ComponentLink1URL: https://www.digikey.ca/product-detail/en/on-semiconductor/MBR0540T1G/MBR0540T1GOSCT-ND/917967; Digikey: SM5817PL-TPMSCT-ND; Digikey Link: https://www.digikey.ca/product-detail/en/micro-commercial-co/SM5817PL-TP/SM5817PL-TPMSCT-ND/1793410; MP: SM5817PL-TP; Voltage Rating: 20V; Package: SOD-123; Current Rating: 1A
P2 P3 = CN MOLEX 4365002XX: MOLEX MICROFIT 2CKT RIGHT THRU; MF: MOLEX; MP: 4365002XX; Digikey: WM17581-ND; Digikey Link: https://www.digikey.com/en/products/detail/molex/0436500205/3310532?s=N4IgTCBcDaICwGYBsBWADGsaUgLoF8g; Package: Microfit; Price: 1.44 CAD; Value: N/A; Supplier 1: Digi-Key
Q6 Q7 = FGY75N60SMD: IGBT Field Stop 600V 150A 750W Through Hole PowerTO-247-3; MF: ON Semiconductor; Vge max: ±20V; Topology: Field Stop IGBT; Vce max: 600V; Package: TO-247 Fairchild Semiconductor; MP: FGY75N60SMD; Ic max: 150A; Power: 750W; Supplier 1: Digi-Key; Supplier Part Number 1: FGY75N60SMDFS-ND
R44#1 R46 = RES 110.0 1/8W - 1%: as R19 on sheet regulation; Package: 0805; Value: 110; Tolerance: 1%
R45 R47 = RES 10k 1/8W - 1%: as R31 on sheet flyback; Package: 0805; Value: 10k; Tolerance: 1%
U7 = IR4427STRPBF: Low-Side Gate Driver IC Non-Inverting 8-SOIC; MF: Infineon Technologies; Package: SOIC-8 Infineon; Price: None; Availability: Unavailable; MP: IR4427STRPBF; SnapEDA_Link: https://www.snapeda.com/parts/IR4427STRPBF/Infineon%20Technologies/view-part/1815787/?ref=snap; Value: *; Supplier 1: Digi-Key; Supplier Part Number 1: IR4427SPBFCT-ND

## Sheet power-input.SchDoc
size A4; SheetNumber: 2
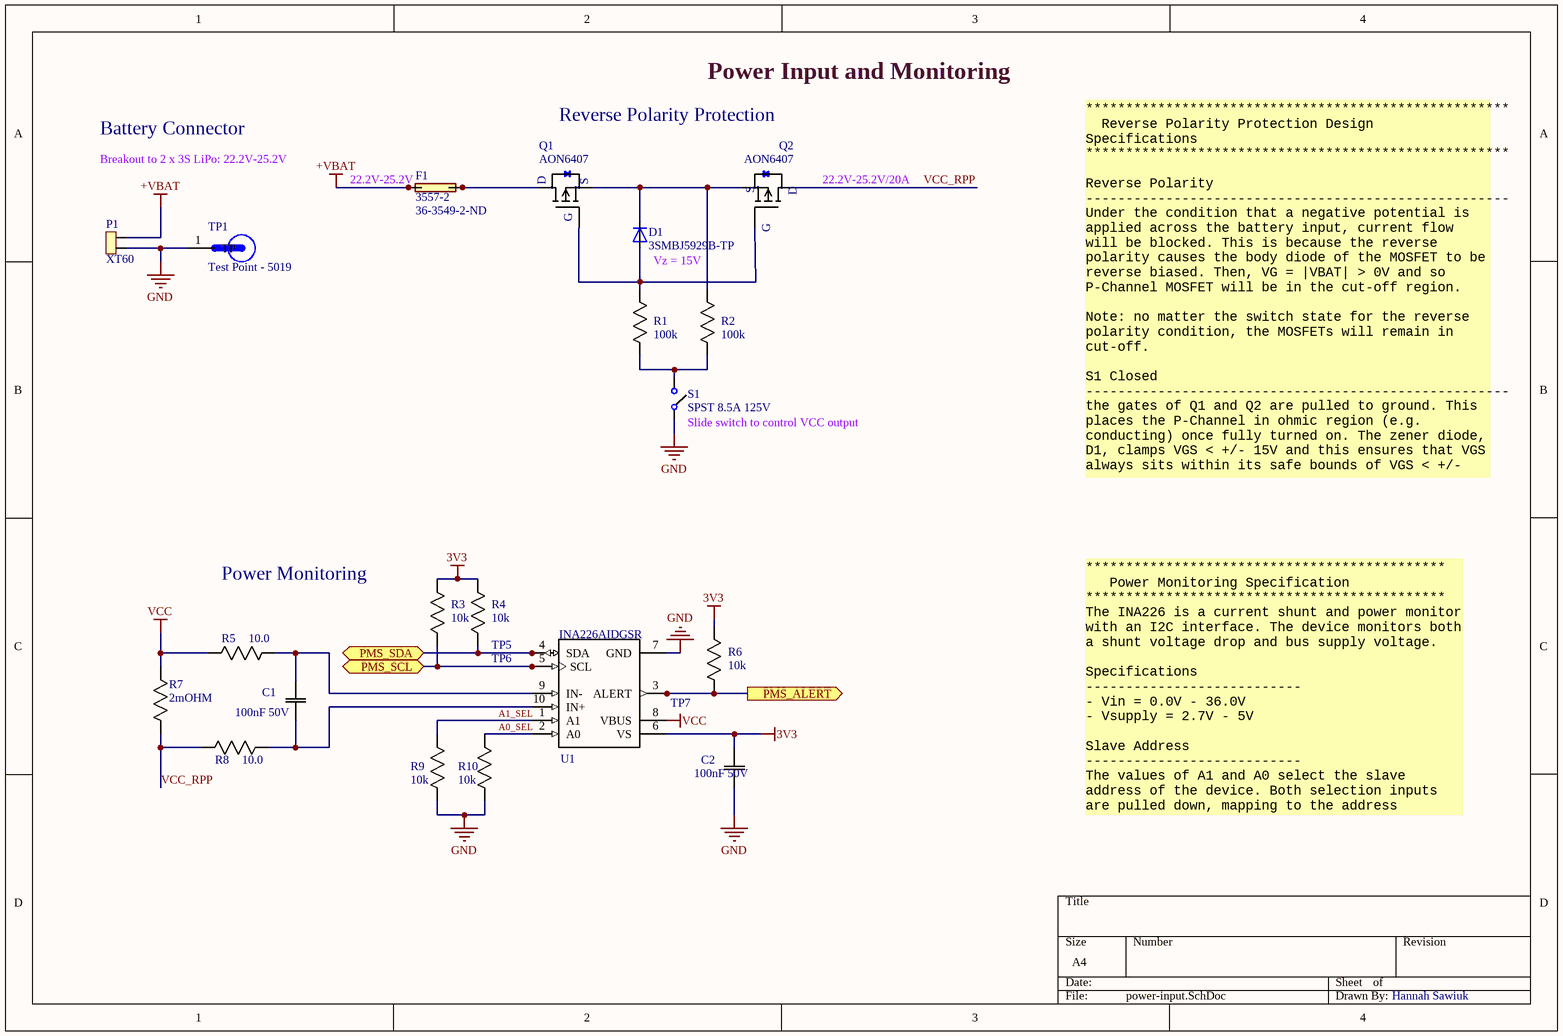
[diagram p4: power-input.SchDoc]

### Parts
(Parts that share a designator on the sheet are numbered #1, #2 ... from top to bottom, then left to right.)
C1  100nF 50V  [0805]
C2  100nF 50V  [0805]
D1  3SMBJ5929B-TP  [SOD-123]
F1  3557-2  Supplier Part Number 2: 36-3549-2-ND  [FUSE_3549-2]
P1  XT60  [Amass_XT60PW-M]
Q1  AON6407  [8-PowerSMD]
Q2  AON6407  [8-PowerSMD]
R1  100k  [0805]
R2  100k  [0805]
R3  10k  [0805]
R4  10k  [0805]
R5  10.0  [0805]
R6  10k  [0805]
R7  2mOHM  [2512]
R8  10.0  [0805]
R9  10k  [0805]
R10  10k  [0805]
S1  SPST 8.5A 125V  [SPST GF-123-0054]
TP1  Test Point - 5019  [TP380X203]
TP5#2  Test Point (Via)  [TP]  (value not drawn)
TP6#2  Test Point (Via)  [TP]  (value not drawn)
TP7#2  Test Point (Via)  [TP]  (value not drawn)
U1  INA226AIDGSR  [10-VSSOP]

### Ports
PMS_ALERT (out), PMS_SCL (bidir), PMS_SDA (bidir)

### Nets
3V3: C2.2(C2) R3.1(R1) R4.1(R1) R6.1(R1) U1.6(VS)
+VBAT: F1.3(2A) F1.4(2B) P1.2
GND: C2.1(C1) P1.1 R9.2(R2) R10.2(R2) S1.0 TP1.1(TP) U1.7(GND)
VCC: R5.2(R2) R7.1(R1) U1.8(VBUS)
A0_SEL: R10.1(R1) U1.2(A0)
A1_SEL: R9.1(R1) U1.1(A1)
PMS_ALERT: R6.2(R2) TP7#2.1 U1.3(ALERT) ; port PMS_ALERT
PMS_SCL: R3.2(R2) TP6#2.1 U1.5(SCL) ; port PMS_SCL
PMS_SDA: R4.2(R2) TP5#2.1 U1.4(SDA) ; port PMS_SDA
VCC_RPP: Q2.D R7.2(R2) R8.2(R2)
NetC1_1: C1.1(C1) R8.1(R1) U1.10(IN+)
NetC1_2: C1.2(C2) R5.1(R1) U1.9(IN-)
NetD1_A: D1.A Q1.G Q2.G R1.1(R1)
NetD1_C: D1.C Q1.S Q2.S R2.1(R1)
NetF1_1: F1.1(1A) F1.2(1B) Q1.D
NetR1_2: R1.2(R2) R2.2(R2) S1.1

### Notes on the sheet
- Power Input and Monitoring
- Battery Connector
- Breakout to 2 x 3S LiPo: 22.2V-25.2V
- Reverse Polarity Protection
- (near F1) 22.2V-25.2V
- (near Q2) 22.2V-25.2V/20A
- Vz = 15V
- (near S1) Slide switch to control VCC output
- *****************************************************
  Reverse Polarity Protection Design Specifications
  *****************************************************
  Reverse Polarity
  -----------------------------------------------------
  Under the condition that a negative potential is applied across the battery input, current flow will be blocked. This is because the reverse polarity causes the body diode of the MOSFET to be reverse biased. Then, VG = |VBAT| > 0V and so P-Channel MOSFET will be in the cut-off region.
  Note: no matter the switch state for the reverse polarity condition, the MOSFETs will remain in cut-off.
  S1 Closed
  -----------------------------------------------------
  the gates of Q1 and Q2 are pulled to ground. This places the P-Channel in ohmic region (e.g. conducting) once fully turned on. The zener diode, D1, clamps VGS < +/- 15V and this ensures that VGS always sits within its safe bounds of VGS < +/- 25V.
- Power Monitoring
- *********************************************
  Power Monitoring Specification
  *********************************************
  The INA226 is a current shunt and power monitor
  with an I2C interface. The device monitors both a shunt voltage drop and bus supply voltage.
  Specifications
  ---------------------------
  - Vin = 0.0V - 36.0V
  - Vsupply = 2.7V - 5V
  Slave Address
  ---------------------------
  The values of A1 and A0 select the slave address of the device. Both selection inputs are pulled down, mapping to the address 1000000.
- Hannah Sawiuk

### Library data of the parts
C1 C2 = CAP 100nF 50V: as C3 on sheet regulation; Package: 0805; Value: 100nF; Rating: 50V
D1 = DIODE ZENER 15V 3W: Supplier 1: Digi-Key; Supplier Part Number 1: 3SMBJ5929BTPMSCT-ND
F1 = FUSE BLADE: Fuse Block 30A 500V 1 Circuit Blade Through Hole; MF: Keystone Electronics; Package: Nonstandard Keystone; Value: *; Price: None; MP: 3557-2; SnapEDA_Link: https://www.snapeda.com/parts/3557-2/Keystone%20Electronics/view-part/278060/?ref=snap; Availability: Unavailable; Supplier 1: Digi-Key; Supplier 2: Digi-Key
P1 = XT60 Connector: XT60 CONNECTORS FEMALE PAIR; MF: SparkFun Electronics; MP: PRT-10474; Digikey: 1568-1816-ND; Digikey Link: https://www.digikey.ca/product-detail/en/sparkfun-electronics/PRT-10474/1568-1816-ND/8258064; Package: XT60; Price: 2.13000 CAD; Value: N/A; Supplier 1: Digi-Key; Supplier Part Number 1: 1568-1816-ND
Q1 Q2 = MOSFET AON6407: MOSFET P-CH 30V 32A 8DFN; MF: Alpha & Omega Semiconductor Inc.; Package: 8-PowerSMD; MP: AON6407; Digikey: 785-1421-1-ND; Digikey Link: https://www.digikey.ca/product-detail/en/alpha-omega-semiconductor-inc/AON6407/785-1421-1-ND/3466800; Supplier 1: Digi-Key; Supplier Part Number 1: 785-1421-1-ND
R1 R2 = RES 100k 1/8W - 1%: as R28 on sheet flyback; Package: 0805; Value: 100k; Tolerance: 1%
R3 R4 R6 R9 R10 = RES 10k 1/8W - 1%: as R31 on sheet flyback; Package: 0805; Value: 10k; Tolerance: 1%
R5 R8 = RES 10.0 1/8W - 1%: RES SMD 10.0 OHM 1% 1/8W 0805; Power (Watts): 0.125W; Package: 0805; Value: 10.0; Tolerance: 1%
R7 = RES 2m 1W: RES SMD 2m OHM 1% 1W 1206; Package: 1206; Resistance: 2mOHM; Power (Watts): 1W; Tolerance: 1%
S1 = SW SLIDE: SWITCH SLIDE SPST 8.5A 125V; MP: GF-123-0054; MF: CW Industries; Digikey: CWI333-ND; Digikey Link: https://www.digikey.com/en/products/detail/cw-industries/GF-123-0054/4089770; Price: 1.25 CAD; Rating: 8.5A 125V; ComponentLink1Description: Digikey; ComponentLink1URL: https://www.digikey.ca/product-detail/en/zf-electronics/SRB22A2FBBNN/CH755-ND/446021; ComponentLink2Description: Datasheet; ComponentLink2URL: http://switches-sensors.zf.com/us/wp-content/uploads/sites/7/2012/10/Rocker_SRB_Datasheet1.pdf
TP1 = Test Point - 5019: as TP8 on sheet flyback; Value: *; Package: 2010 Keystone; Digi-Key_Part_Number: 36-5019CT-ND; Digi-Key_Purchase_URL: https://www.digikey.com/product-detail/en/keystone-electronics/5019/36-5019CT-ND/3907344?utm_source=snapeda&utm_medium=aggregator&utm_campaign=symbol
U1 = IC INA226AIDGSR: 36-V, Bi-Directional, Ultra-High Accuracy, Low-/High-Side, I2C Out Current/Power Monitor w/ Alert 10-VSSOP -40 to 125; MF: Texas Instruments; Price: None; MP: INA226AIDGSR; SnapEDA_Link: https://www.snapeda.com/parts/INA226AIDGSR/Texas%20Instruments/view-part/53552/?ref=snap; Package: MSOP-10 Texas Instruments; Digikey: 296-29034-1-ND; Digikey Link: https://www.digikey.ca/product-detail/en/texas-instruments/INA226AIDGSR/296-29034-1-ND/2687118; Supplier 1: Digi-Key; Supplier Part Number 1: 296-29034-6-ND

## Sheet communication.SchDoc
size A4; SheetNumber: 8
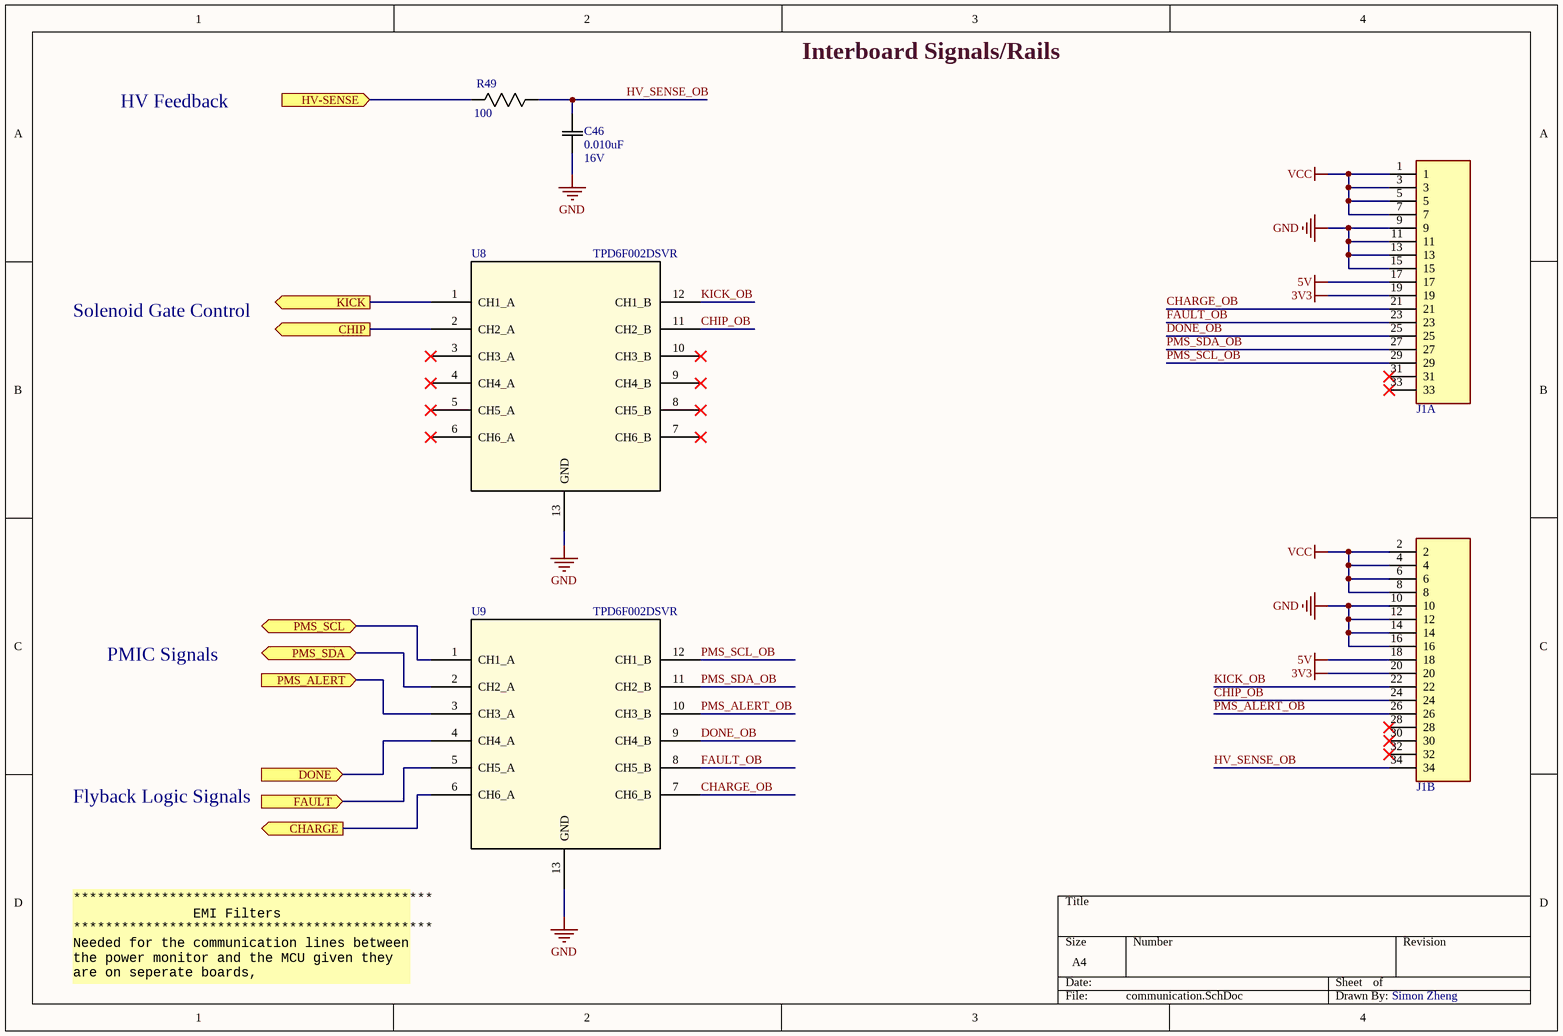
[diagram p5: communication.SchDoc]

### Parts
C46  Rating: 16V  [0805]  (hidden comment: 0.010uF)
J1  0.1" Header Female 34  [SAMTEC_ESQ-117-12-L-D]  (value not drawn)  (parts A,B of 2)
R49  100  [0805]
U8  TPD6F002DSVR  [PSON50P140X80_HS-13N]
U9  TPD6F002DSVR  [PSON50P140X80_HS-13N]

### Ports
CHARGE (out), CHIP (out), DONE (in), FAULT (in), HV-SENSE (in), KICK (out), PMS_ALERT (in), PMS_SCL (bidir), PMS_SDA (bidir)

### Nets
3V3: J1.19 J1.20
5V: J1.17 J1.18
GND: C46.2(C2) J1.9 J1.10 J1.11 J1.12 J1.13 J1.14 J1.15 J1.16 U8.13(GND) U9.13(GND)
VCC: J1.1 J1.2 J1.3 J1.4 J1.5 J1.6 J1.7 J1.8
CHARGE: U9.6(CH6_A) ; port CHARGE
CHARGE_OB: J1.21 U9.7(CH6_B)
CHIP: U8.2(CH2_A) ; port CHIP
CHIP_OB: J1.24 U8.11(CH2_B)
DONE: U9.4(CH4_A) ; port DONE
DONE_OB: J1.25 U9.9(CH4_B)
FAULT: U9.5(CH5_A) ; port FAULT
FAULT_OB: J1.23 U9.8(CH5_B)
HV-SENSE: R49.2(R2) ; port HV-SENSE
HV_SENSE_OB: C46.1(C1) J1.34 R49.1(R1)
KICK: U8.1(CH1_A) ; port KICK
KICK_OB: J1.22 U8.12(CH1_B)
PMS_ALERT: U9.3(CH3_A) ; port PMS_ALERT
PMS_ALERT_OB: J1.26 U9.10(CH3_B)
PMS_SCL: U9.1(CH1_A) ; port PMS_SCL
PMS_SCL_OB: J1.29 U9.12(CH1_B)
PMS_SDA: U9.2(CH2_A) ; port PMS_SDA
PMS_SDA_OB: J1.27 U9.11(CH2_B)

Not connected (* = marked no-connect by the designer): J1 28* 30* 31* 32* 33*; U8 3(CH3_A)* 4(CH4_A)* 5(CH5_A)* 6(CH6_A)* 7(CH6_B)* 8(CH5_B)* 9(CH4_B)* 10(CH3_B)*

### Notes on the sheet
- HV Feedback
- Interboard Signals/Rails
- Solenoid Gate Control
- PMIC Signals
- Flyback Logic Signals
- *********************************************
  EMI Filters
  *********************************************
  Needed for the communication lines between the power monitor and the MCU given they are on seperate boards,
- Simon Zheng

### Library data of the parts
C46 = CAP 0.010uF 16V: CAP CER 0.010UF 16V X5R 0603/0805; Tolerance: 10%; Package: 0603/0805; Temperature Coefficient: X5R; Operating Temperature: -55°C ~ 85°C; Value: 0.010uF
J1 = CN HDR 34POS 2x17: Female Header THRU 34POS 2ROW 0.1" (2.54mm) pitch
R49 = RES 100.0 1/8W: RES SMD 100 OHM 5% 1/8W 0805; Power (Watts): 0.125W; Package: 0805; Value: 100; Tolerance: 5%
U8 U9 = EMI FILTER TPD6F002DSVR: 6-Channel EMI Filter for Display Interface; Manufacturer: Texas Instruments; INDUSTRY_STD_PKG_TYPE: SON; FAMILY_NAME: EMI Solution; PIN_COUNT: 12; PACKAGE_DESIGNATOR: DSV; Datasheet_URL: http://www.ti.com/lit/gpn/TPD6F002; GENERIC_PART_NUMBER: TPD6F002; Vendor: Texas Instruments; Manufacturer_Part_Number: TPD6F002DSVR; Copyright: Copyright (C) 2018 Accelerated Designs. All rights reserved; RefDes: RefDes; Type: DEV

## Sheet auto-discharge.SchDoc
size A; SheetNumber: 5
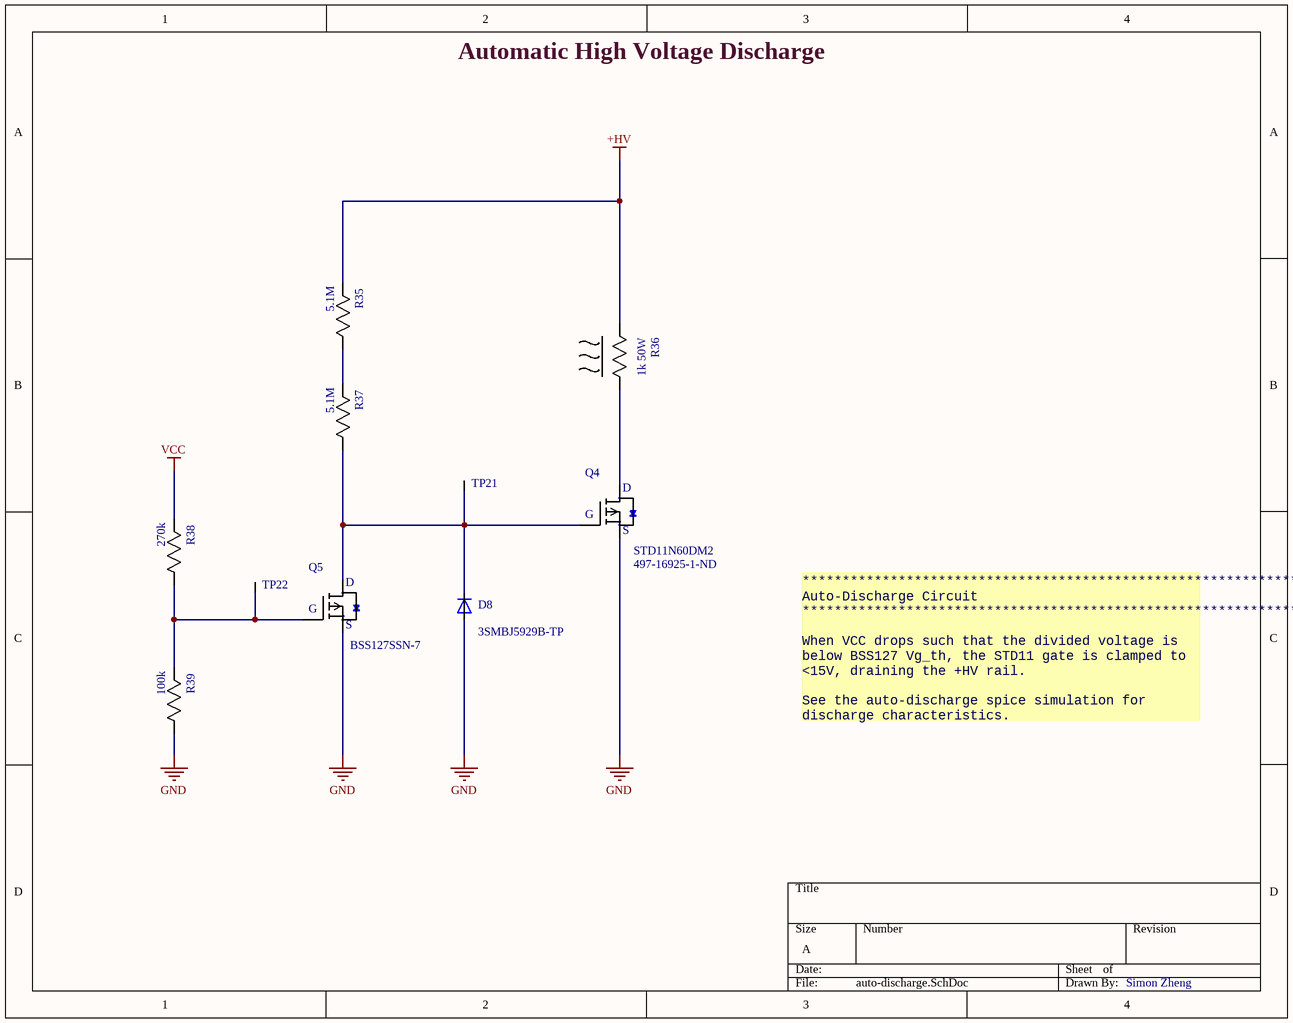
[diagram p6: auto-discharge.SchDoc]

### Parts
(Parts that share a designator on the sheet are numbered #1, #2 ... from top to bottom, then left to right.)
D8  3SMBJ5929B-TP  [DO-214AA]
Q4  STD11N60DM2  Supplier Part Number 1: 497-16925-1-ND  [DPAK (TO-252)]
Q5  BSS127SSN-7  [SOT95P245X89-3M]
R35#2  5.1M  [0805]
R36  1k 50W  [D2PAK (TO-263)]
R37  5.1M  [0805]
R38  270k  [0805]
R39  100k  [0805]
TP21  Test Point (Via)  [TP]  (value not drawn)
TP22  Test Point (Via)  [TP]  (value not drawn)

### Nets
+HV: R35#2.2(R2) R36.2(R2)
GND: D8.A Q4.S Q5.S R39.1(R1)
VCC: R38.2(R2)
NetD8_C: D8.C Q4.G Q5.D R37.1(R1) TP21.1
NetQ4_D: Q4.D R36.1(R1)
NetQ5_G: Q5.G R38.1(R1) R39.2(R2) TP22.1
NetR35#2_1: R35#2.1(R1) R37.2(R2)

Not connected (* = marked no-connect by the designer): R36 3

### Notes on the sheet
- Automatic High Voltage Discharge
- **********************************************************************
  Auto-Discharge Circuit
  **********************************************************************
  When VCC drops such that the divided voltage is below BSS127 Vg_th, the STD11 gate is clamped to <15V, draining the +HV rail.
  See the auto-discharge spice simulation for discharge characteristics.
- Simon Zheng

### Library data of the parts
D8 = DIODE ZENER 15V 3W: Supplier 1: Digi-Key; Supplier Part Number 1: 3SMBJ5929BTPMSCT-ND
Q4 = STD11N60DM2: pin to pad: D>2 G>1 S>3; MFG: STMicroelectronics; Supplier: Digikey; Supplier PN: 497-16925-1-ND; Supplier 1: Digi-Key
Q5 = BSS127SSN-7: Small Signal N-Ch, 600Vds; MFG: Diodes Incorporated; Supplier: Digikey; Supplier PN: BSS127SSN-7DICT-ND
R35#2 R37 = RES 5.1M 1/8W-5%: RES SMD 5.1 MOHM 5% 1/8W 0805; Power (Watts): 0.125W; Package: 0805; Value: 5.1M; Tolerance: 5%
R36 = RES 1.5k 50W: RES SMD 1.5K OHM 1% 50W D2PAK; Package: D2PAK (TO-263); Value: 1.5k; Power (Watts): 50W; Tolerance: 1%
R38 = RES 270k 1/8W: RES SMD 270K OHM 5% 1/8W 0805; Power (Watts): 0.125W; Package: 0805; Value: 270k; Tolerance: 5%
R39 = RES 100k 1/8W - 1%: as R28 on sheet flyback; Package: 0805; Value: 100k; Tolerance: 1%